# EAGLE design record_revb (EAGLE 7.2.0)
Ekho Mobile Recording Front-End Board (Rev A) Provides signal conditioning, amplification, and adjustment for the I-V Controller.

## Sheet 1 of 3: Recording Analog Front-End
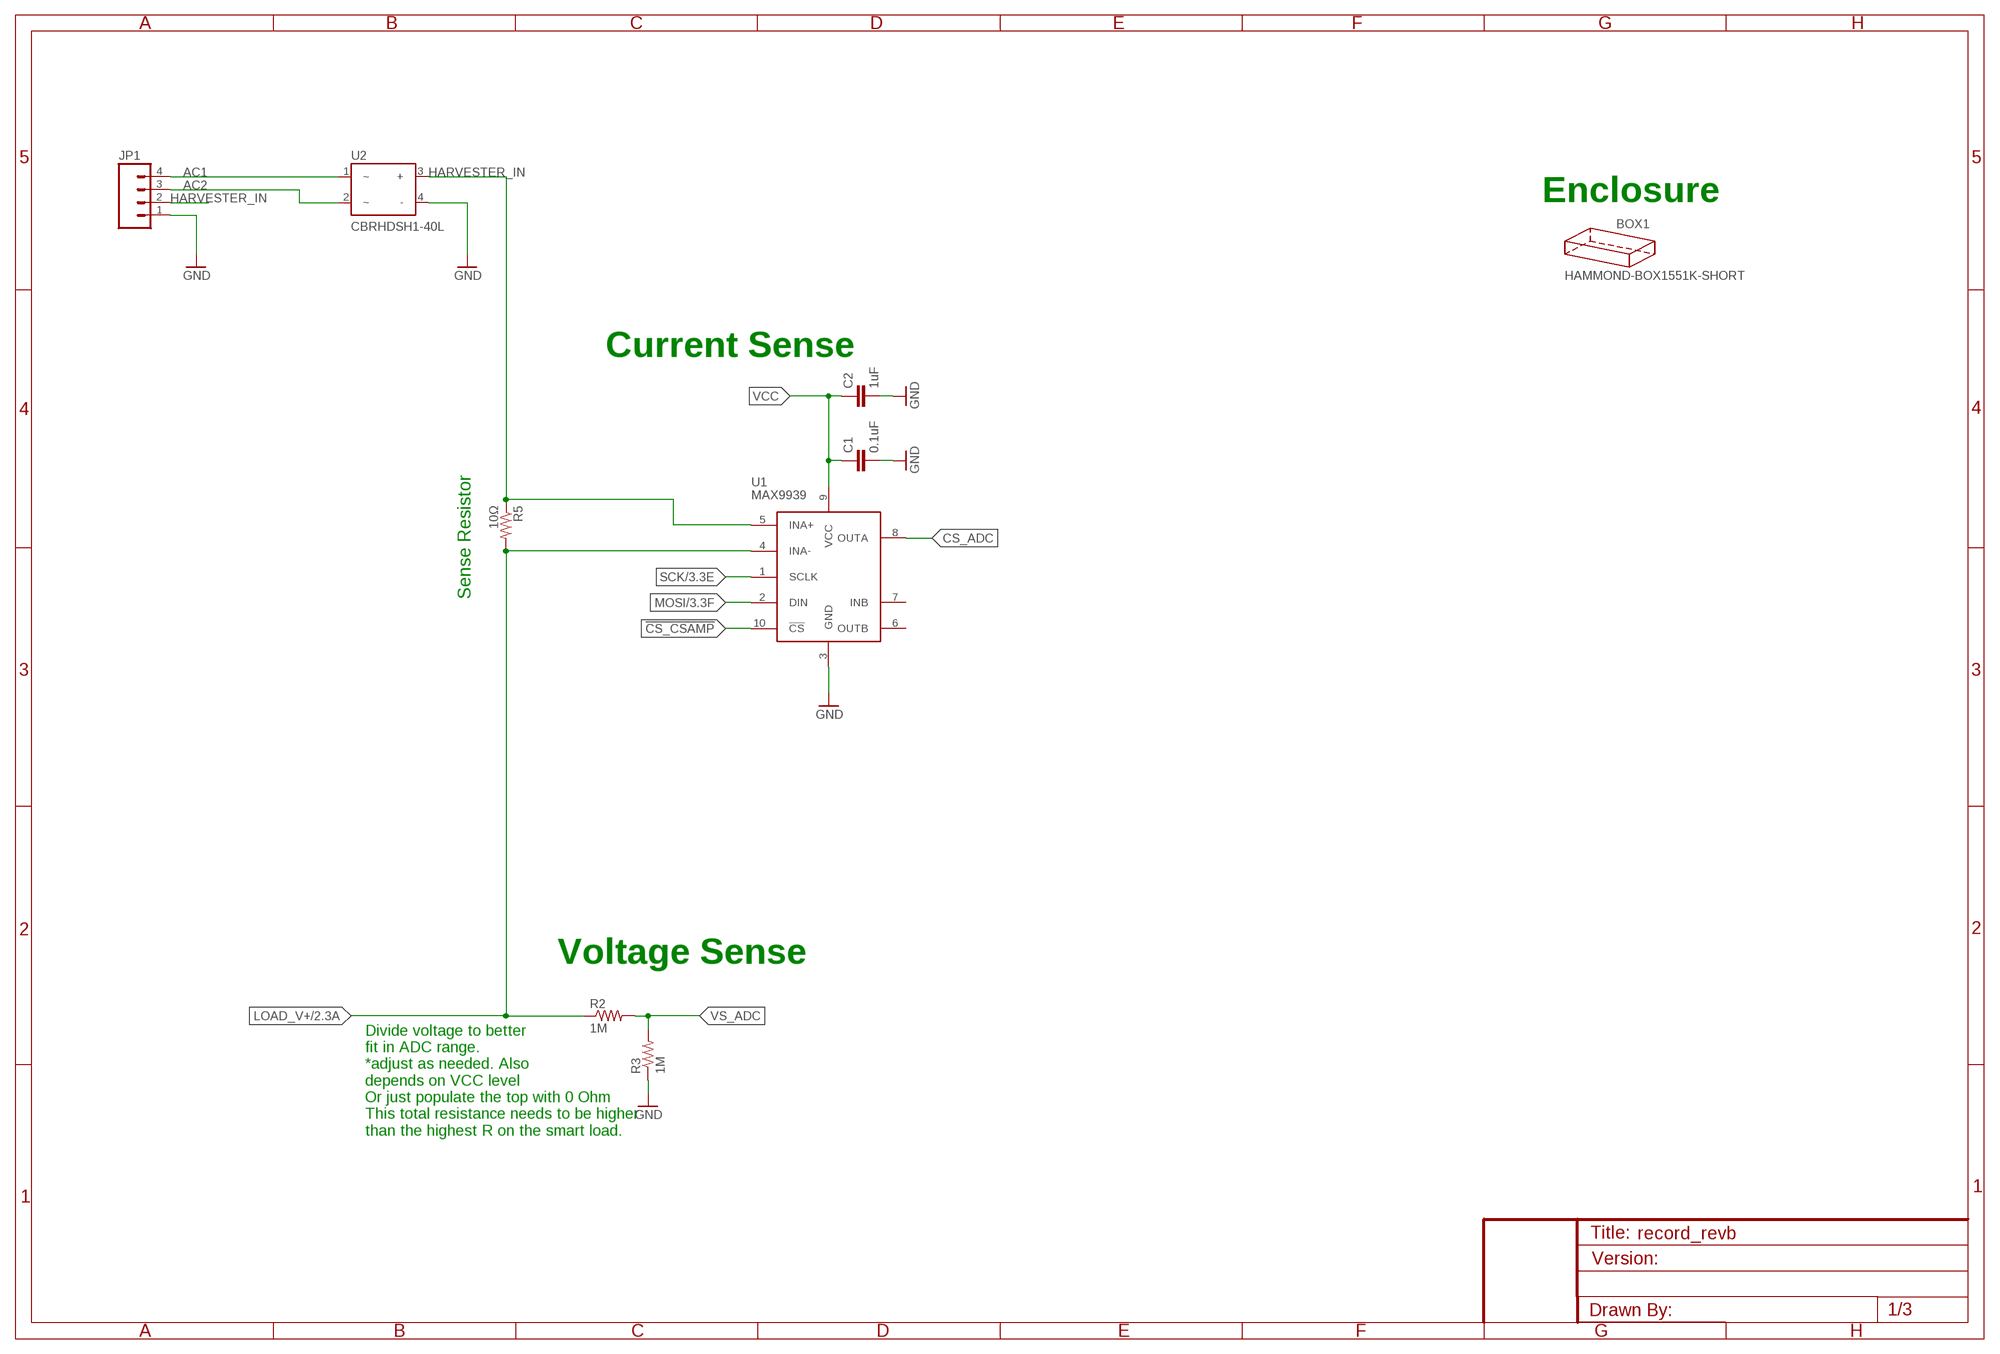
[diagram p0: schematic, sheet 1]

### Parts
BOX1  HAMMOND-BOX1551K-SHORT  [1551K-SHORT]
C1  0.1uF  CAP0805  [C0805]
C2  1uF  CAP0805  [C0805]
JP1  M04PTH  [1X04]
R2  1M  RESISTOR0805-RES  [0805]
R3  1M  RESISTOR0805-RES  [0805]
R5  10Ω  RESISTOR0805-RES  [0805]
U1  MAX9939  [10µMAX]
U2  CBRHDSH1-40L  [HD_DIP4]

### Nets
!CS_CSAMP: U1.10(!CS) ; also sheet 2
AC1: JP1.4 U2.1(~)
AC2: JP1.3 U2.2(~)
CS_ADC: U1.8(OUTA) ; also sheet 2
GND: C1.2 C2.2 JP1.1 R3.1 U1.3(GND) U2.4(-) ; also sheet 2,3
HARVESTER_IN: JP1.2 R5.1 U1.5(INA+) U2.3(+)
LOAD_V+: R2.1 R5.2 U1.4(INA-) ; also sheet 2
MOSI: U1.2(DIN) ; also sheet 2,3
SCK: U1.1(SCLK) ; also sheet 2,3
VCC: C1.1 C2.1 U1.9(VCC) ; also sheet 2,3
VS_ADC: R2.2 R3.2 ; also sheet 2
Unconnected: U1.6(OUTB) U1.7(INB)

### Notes on the sheet
- Enclosure
- Current Sense
- Sense Resistor
- Voltage Sense
- Divide voltage to better 
  fit in ADC range.
  *adjust as needed. Also
  depends on VCC level
  Or just populate the top with 0 Ohm
  This total resistance needs to be higher
  than the highest R on the smart load.

## Sheet 2 of 3: Digital Ctrl, Battery, Smart Load
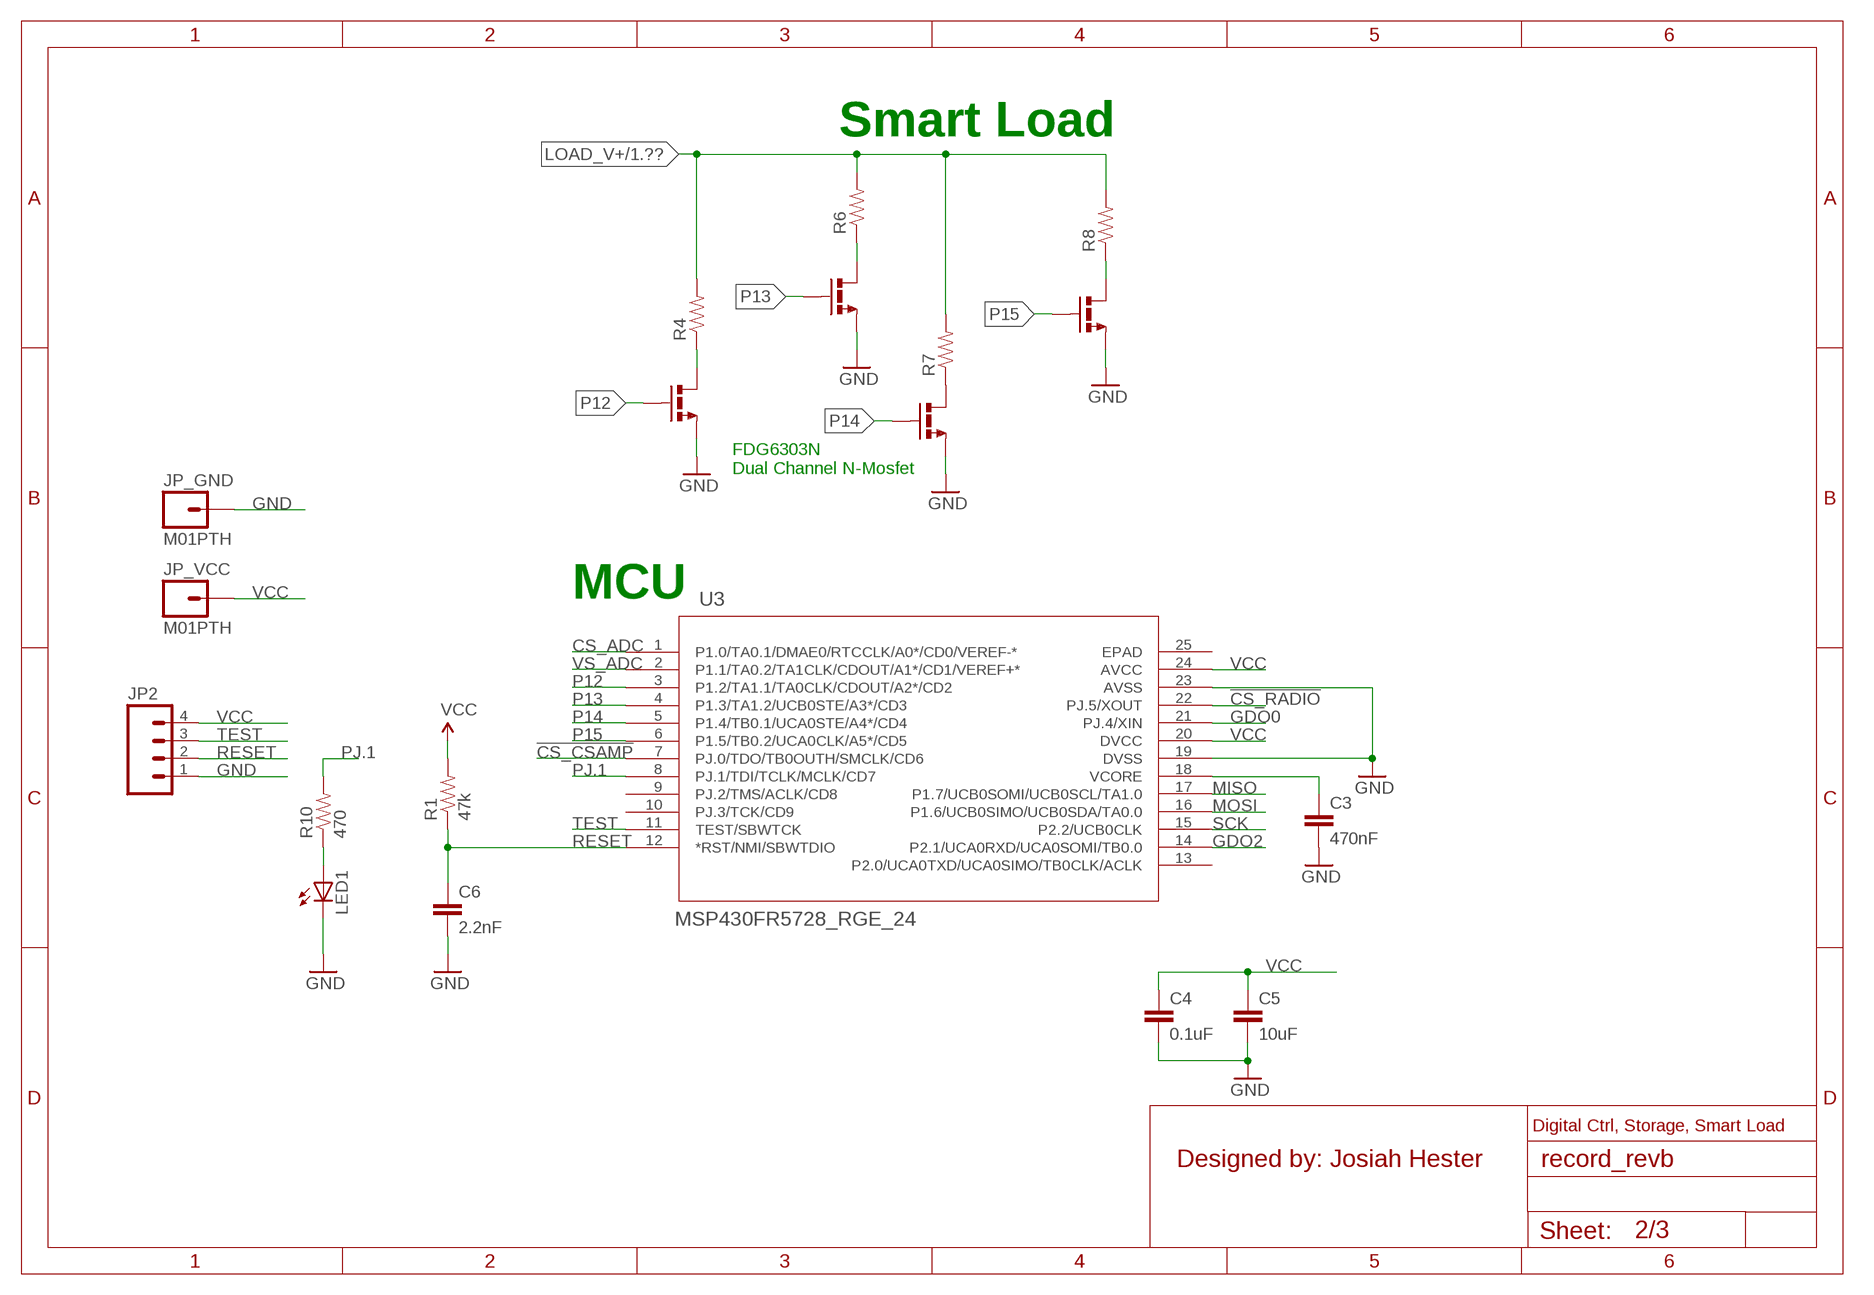
[diagram p1: schematic, sheet 2]

### Parts
C3  470nF  1UF-25V-10%(0805)  [0805]
C4  0.1uF  1UF-25V-10%(0805)  [0805]
C5  10uF  1UF-25V-10%(0805)  [0805]
C6  2.2nF  1UF-25V-10%(0805)  [0805]
JP2  M04PTH  [1X04]
JP_GND  M01PTH  [1X01]
JP_VCC  M01PTH  [1X01]
LED1  LED0603  [LED-0603]
R1  47k  0.22OHM1/4W1%(0805)  [0805]
R4  0.22OHM1/4W1%(0805)  [0805]
R6  0.22OHM1/4W1%(0805)  [0805]
R7  0.22OHM1/4W1%(0805)  [0805]
R8  0.22OHM1/4W1%(0805)  [0805]
R10  470  0.22OHM1/4W1%(0805)  [0805]
U3  MSP430FR5728_RGE_24  [RGE24_2P1X2P1]
U4  FDG6303N  [SC70-6]
U5  FDG6303N  [SC70-6]

### Nets
!CS_CSAMP: U3.7(PJ.0/TDO/TB0OUTH/SMCLK/CD6) ; also sheet 1
!CS_RADIO: U3.22(PJ.5/XOUT) ; also sheet 3
CS_ADC: U3.1(P1.0/TA0.1/DMAE0/RTCCLK/A0*/CD0/VEREF-*) ; also sheet 1
GDO0: U3.21(PJ.4/XIN) ; also sheet 3
GDO2: U3.14(P2.1/UCA0RXD/UCA0SOMI/TB0.0) ; also sheet 3
GND: C3.2 C4.2 C5.2 C6.2 JP2.1 JP_GND.1 LED1.C U3.19(DVSS) U3.23(AVSS) U4.1(S2) U4.4(S1) U5.1(S2) U5.4(S1) ; also sheet 1,3
LOAD_V+: R4.2 R6.2 R7.2 R8.2 ; also sheet 1
MISO: U3.17(P1.7/UCB0SOMI/UCB0SCL/TA1.0) ; also sheet 3
MOSI: U3.16(P1.6/UCB0SIMO/UCB0SDA/TA0.0) ; also sheet 1,3
N$1: C3.1 U3.18(VCORE)
N$3: R7.1 U5.3(D1)
N$4: R8.1 U5.6(D2)
N$5: R6.1 U4.6(D2)
N$6: R4.1 U4.3(D1)
N$11: LED1.A R10.1
P12: U3.3(P1.2/TA1.1/TA0CLK/CDOUT/A2*/CD2) U4.5(G1)
P13: U3.4(P1.3/TA1.2/UCB0STE/A3*/CD3) U4.2(G2)
P14: U3.5(P1.4/TB0.1/UCA0STE/A4*/CD4) U5.5(G1)
P15: U3.6(P1.5/TB0.2/UCA0CLK/A5*/CD5) U5.2(G2)
PJ.1: R10.2 U3.8(PJ.1/TDI/TCLK/MCLK/CD7)
RESET: C6.1 JP2.2 R1.1 U3.12(*RST/NMI/SBWTDIO)
SCK: U3.15(P2.2/UCB0CLK) ; also sheet 1,3
TEST: JP2.3 U3.11(TEST/SBWTCK)
VCC: C4.1 C5.1 JP2.4 JP_VCC.1 R1.2 U3.20(DVCC) U3.24(AVCC) ; also sheet 1,3
VS_ADC: U3.2(P1.1/TA0.2/TA1CLK/CDOUT/A1*/CD1/VEREF+*) ; also sheet 1
Unconnected: U3.9(PJ.2/TMS/ACLK/CD8) U3.10(PJ.3/TCK/CD9) U3.13(P2.0/UCA0TXD/UCA0SIMO/TB0CLK/ACLK) U3.25(EPAD)

### Notes on the sheet
- Smart Load
- FDG6303N
  Dual Channel N-Mosfet
- MCU
- Digital Ctrl, Storage, Smart Load
- Designed by: Josiah Hester

## Sheet 3 of 3
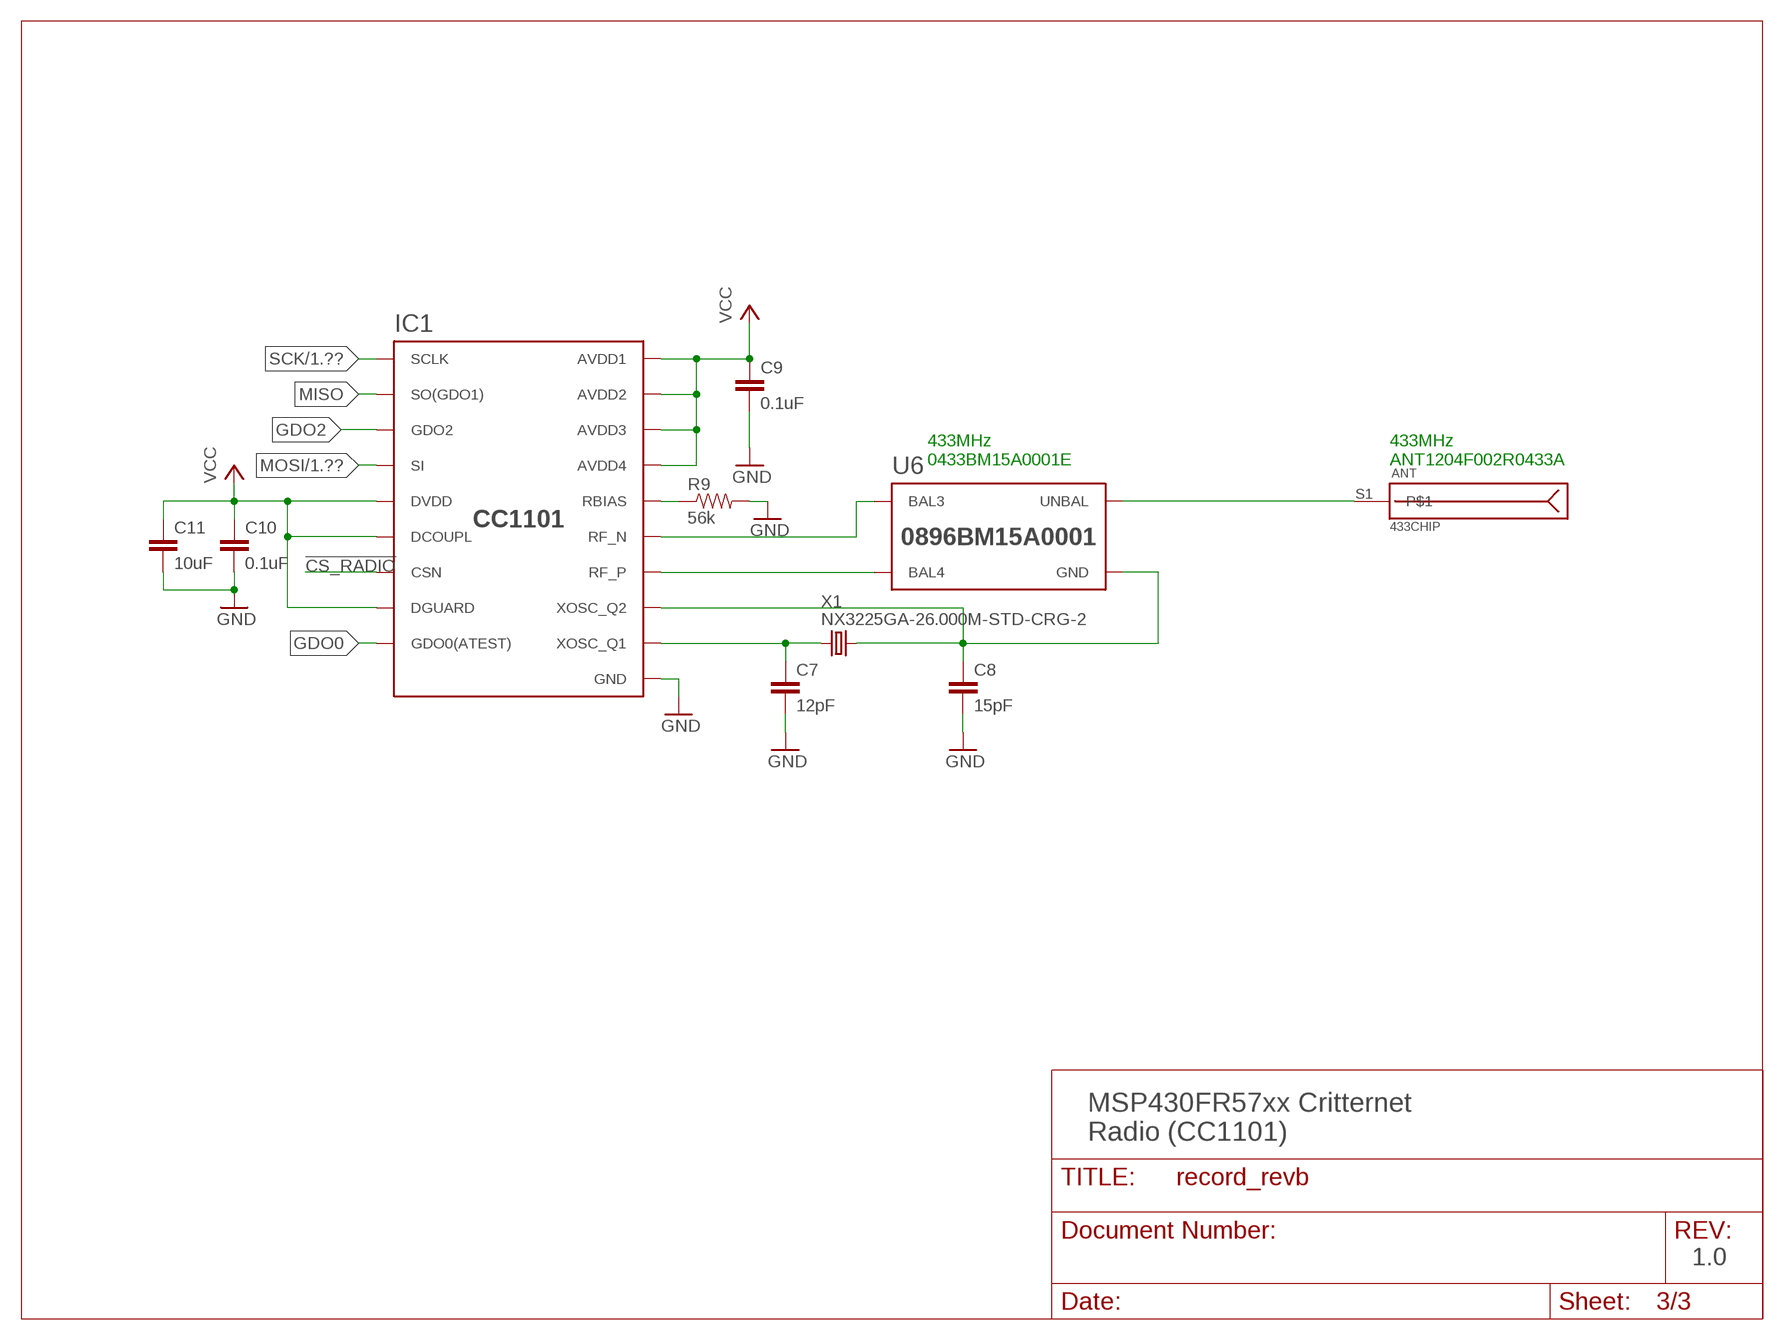
[diagram p2: schematic, sheet 3]

### Parts
ANT  433CHIP  [ANT-433-USP]
C7  12pF  0.1UF-25V(+80/-20%)(0603)  [0603-CAP]
C8  15pF  0.1UF-25V(+80/-20%)(0603)  [0603-CAP]
C9  0.1uF  CAP0603-CAP  [0603-CAP]
C10  0.1uF  CAP0805  [C0805]
C11  10uF  1.0UF-25V-+80/-20(0805)  [0805]
IC1  CC1101  [QLP20]
R9  56k  0OHM1/10W5%(0603)  [0603]
U6  0896BM15A0001  [0896BM15A0001]
X1  NX3225GA-26.000M-STD-CRG-2  XTAL-3.2X2.5  [XTAL-3.2X2.5]

### Nets
!CS_RADIO: IC1.7(CSN) ; also sheet 2
GDO0: IC1.6(GDO0(ATEST)) ; also sheet 2
GDO2: IC1.3(GDO2) ; also sheet 2
GND: C7.2 C8.2 C9.2 C10.2 C11.2 IC1.16(GND) IC1.19(GND) IC1.GND IC1.GND1(GND) IC1.GND2(GND) IC1.GND3(GND) IC1.GND4(GND) IC1.GND5(GND) R9.2 ; also sheet 1,2
MISO: IC1.2(SO(GDO1)) ; also sheet 2
MOSI: IC1.20(SI) ; also sheet 1,2
N$2: IC1.12(RF_P) U6.4(BAL4)
N$7: IC1.13(RF_N) U6.3(BAL3)
N$8: C7.1 IC1.8(XOSC_Q1) X1.1
N$9: IC1.17(RBIAS) R9.1
N$15: ANT.S1 U6.1(UNBAL)
SCK: IC1.1(SCLK) ; also sheet 1,2
VCC: C9.1 C10.1 C11.1 IC1.4(DVDD) IC1.5(DCOUPL) IC1.9(AVDD1) IC1.11(AVDD2) IC1.14(AVDD3) IC1.15(AVDD4) IC1.18(DGUARD) ; also sheet 1,2
XOSC_Q2: C8.1 IC1.10(XOSC_Q2) U6.2(GND) U6.5(GND) U6.6(GND) X1.3

### Notes on the sheet
- 433MHz
  0433BM15A0001E
- 433MHz
  ANT1204F002R0433A
- MSP430FR57xx Critternet
  Radio (CC1101)
- 1.0

## Library data of the parts
ANT = HF-Bauteile:433CHIP
BOX1 = hammond:HAMMOND-BOX: Hammond Project boxes Hammond 1551 Transluscent Blue 50x35x20mm 1551GTBU http://www.hammondmfg.com/pdf/1551G.pdf Hammond 1551 Transluscent Blue 50x50x20mm 1551RTBU http://www.hammondmfg.com/pdf/1551R.pdf Hammond 1551 Transluscent Blue 60x35x20mm 1551HTBU http://www.hammondmfg.com/pdf/1551H.pdf Hammond 1551 Transluscent Blue 80x40x20mm 1551KTBU http://www.hammondmfg.com/pdf/1551K.pdf Hammond 1591 Transluscent Blue 100x51x22m m 1591XXATBU http://www.hammondmfg.com/pdf/1591XXA.pdf
C1 C2 C9 C10 = SparkFun-Capacitors:CAP: Capacitor Standard 0603 ceramic capacitor, and 0.1" leaded capacitor.
C3-C6 = SparkFun-Capacitors:1UF-25V-10%(0805): CAP-08064; PROD_ID: CAP-08064; VALUE: 1uF
C7 C8 = SparkFun-Capacitors:0.1UF-25V(+80/-20%)(0603): CAP-00810 Ceramic Standard decoupling cap; PROD_ID: CAP-00810; VALUE: 0.1uF
C11 = SparkFun-Capacitors:1.0UF-25V-+80/-20(0805); PROD_ID: CAP-11625; VALUE: 1.0uF
IC1 = cc1101:CC1101
JP1 JP2 = SparkFun-Connectors:M04: Header 4 Standard 4-pin 0.1" header. Use with straight break away headers (SKU : PRT-00116), right angle break away headers (PRT-00553), swiss pins (PRT-00743), machine pins (PRT-00117), and female headers (PRT-00115). Molex polarized connector foot print use with SKU : PRT-08231 with associated crimp pins and housings. 1MM SMD Version SKU: PRT-10208
JP_GND JP_VCC = SparkFun-Connectors:M01: Header 1 Standard 1-pin 0.1" header. Use with straight break away headers (SKU : PRT-00116), right angle break away headers (PRT-00553), swiss pins (PRT-00743), machine pins (PRT-00117), and female headers (PRT-00115).
LED1 = SparkFun-LED:LED: LEDs Standard schematic elements and footprints for 5mm, 3mm, 1206, and 0603 sized LEDs. 5mm - Spark Fun Electronics SKU : COM-00529 (and others)
R1 R4 R6-R8 R10 = SparkFun-Resistors:0.22OHM1/4W1%(0805): RES-09883; PROD_ID: RES-09883; VALUE: 0.22
R2 R3 = SparkFun-Resistors:RESISTOR: Resistor Basic schematic elements and footprints for 0603, 1206, and PTH resistors.
R5 = SparkFun-Passives:RESISTOR: Resistor Basic schematic elements and footprints for 0603, 1206, and PTH resistors.
R9 = SparkFun-Resistors:0OHM1/10W5%(0603): RES-08609; PROD_ID: RES-08609; VALUE: 0
U1 = ekho:MAX9939: MAX9939: SPI Programmable-Gain Amplifier with Input VOS Trim and Output Op Amp The MAX9939 is a general-purpose, differential-input programmable-gain amplifier (PGA) that is ideal for conditioning a variety of wide dynamic range signals such as those found in motor current-sense, medical instrumentation, and sonar data acquisition applications. It features programmable differential gains from 0.2V/V to 157V/V, input offset-voltage compensation, and an output amplifier that can be configured either as a highorder active filter or to provide a differential output. The PGA is optimized for high-signal bandwidth and its gain can be programmed to be 0.2V/V, 1V/V, 10V/V, 20V/V, 30V/V, 40V/V, 60V/V, 80V/V, 119V/V, and 157V/V.
U2 = parts:CBRHDSH1-40L
U3 = msp430:MSP430FR5728_RGE_24; DATASHEETURL: http://www.ti.com/lit/gpn/MSP430FR5728; DESCRIPTION: MSP430FR573x,MSP430FR572x Mixed Signal Microcontroller; FAMILY_NAME: FRAM Series; GENERIC_PART_NUMBER: MSP430FR5728; INDUSTRY_STD_PKG_TYPE: VQFN; MANUFACTURER: Texas Instruments; MANUFACTURER_PART_NUMBER: msp430fr5728_rge_24; PACKAGE_DESIGNATOR: RGE; PIN_COUNT: 24; VENDOR: Texas Instruments
U4 U5 = SparkFun-DiscreteSemi:FDG6303N
U6 = otternet:0896BM15A0001
X1 = cc1101:XTAL

## Net classes
1 Ground: width 0.203 mm, drill 0.61 mm

## Board
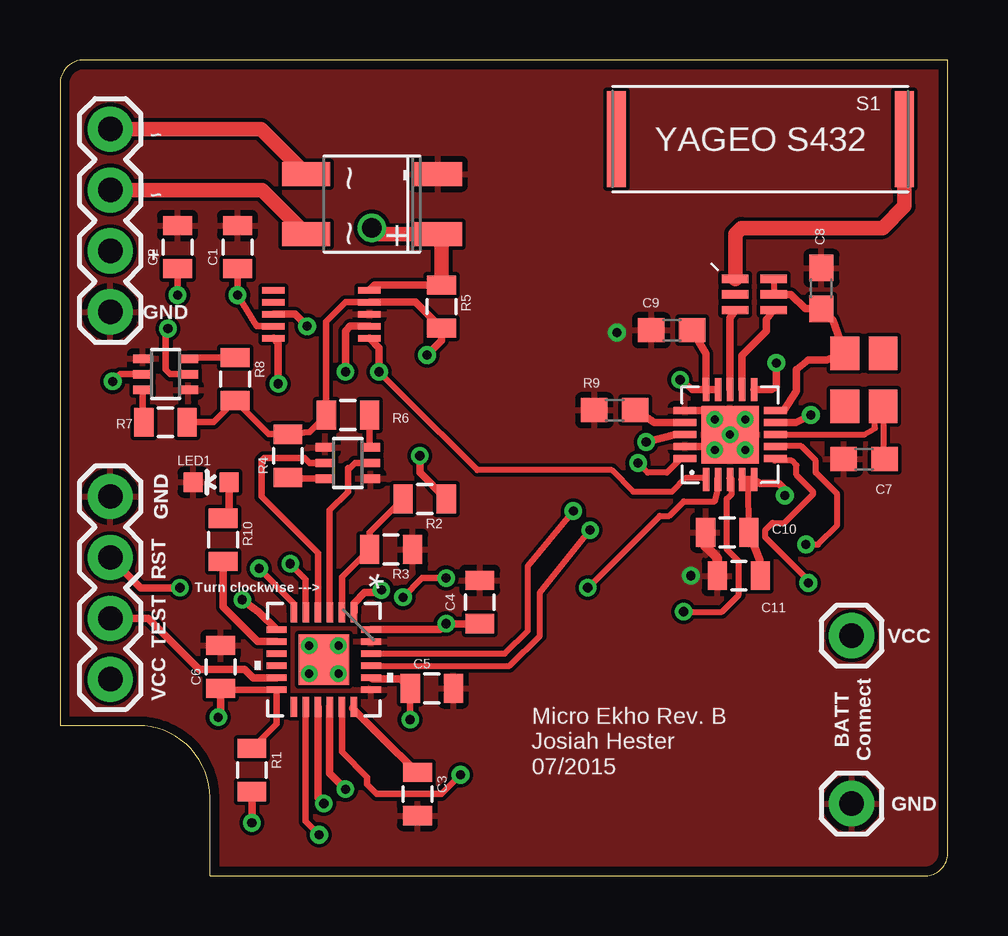
[diagram p3: board, top side]
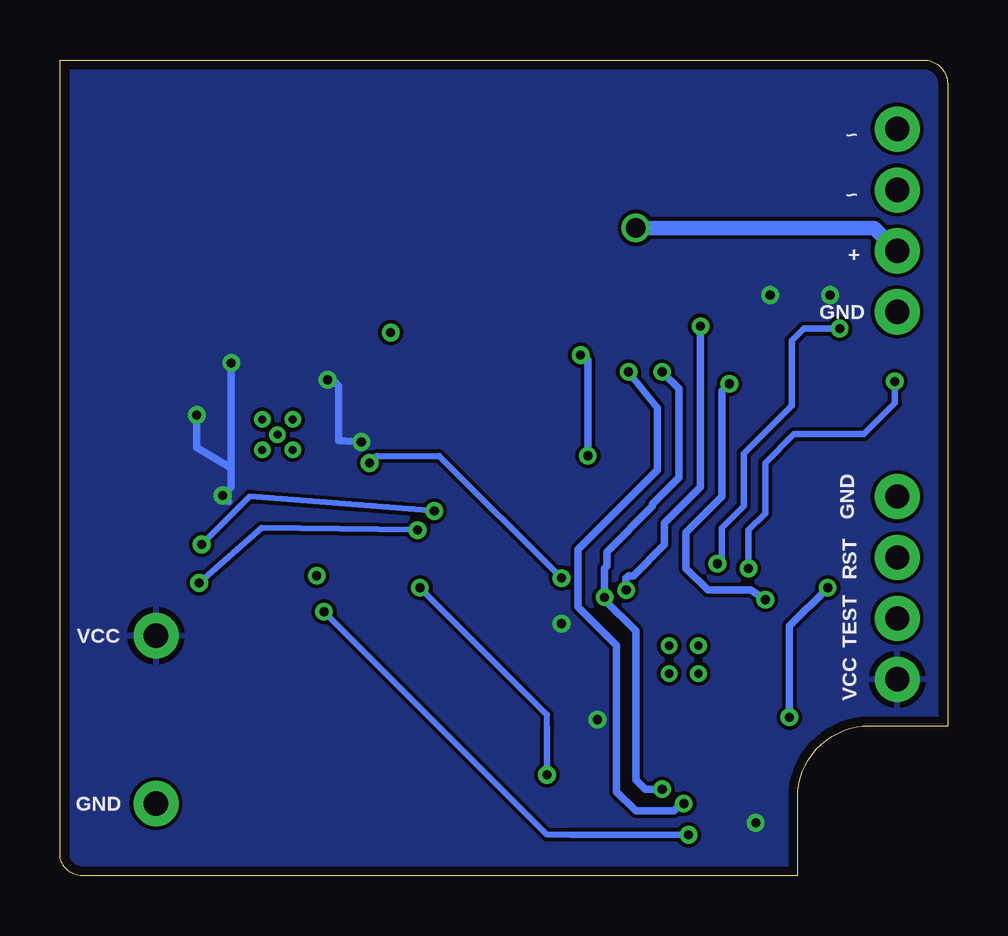
[diagram p4: board, bottom side, seen from below]

Size 37 x 34 mm. Coordinates in mm from the lower left corner, seen from the top.
Copper layers (1*2+15*16): Top 0.0356mm / dielectric 1.5011mm / Route2 0.0356mm / dielectric 0.1499mm / Route15 0.0356mm / dielectric 0.2007mm / Bottom 0.0356mm
Design rules "LaenPCBOrder *": minimum track width 6mil, minimum drill 13mil, track to track 6mil, track to pad 6mil, pad to pad 6mil, via to via 6mil, smd to smd 6mil, copper to edge 15mil, drill to drill 6mil, minimum pad ring 7mil, minimum via ring 7mil, stop-mask expansion 3mil, vias tented up to drill 0mil, thermal gap 10mil

### Footprints (pad centres in the part's own frame; a part is rotated, then mirrored left to right if it is on the bottom)
ANT-433-USP = smd 0.8 x 4: P$4 6,0; S1 -6,0
C0805 = smd 0.8 x 1.2: 1 -0.9,0; 2 0.9,0
0805 = smd 0.8 x 1.2: 1 -0.9,0; 2 0.9,0
0603-CAP = smd 1.1 x 1: 1 -0.85,0; 2 0.85,0
QLP20 = smd 0.96 x 0.28: 1 -1.88,1; 2 -1.88,0.5; 3 -1.88,0; 4 -1.88,-0.5; 5 -1.88,-1; 11 1.88,-1; 12 1.88,-0.5; 13 1.88,0; 14 1.88,0.5; 15 1.88,1 | smd 0.28 x 0.96: 6 -1,-1.88; 7 -0.5,-1.88; 8 0,-1.88; 9 0.5,-1.88; 10 1,-1.88; 16 1,1.88; 17 0.5,1.88; 18 0,1.88; 19 -0.5,1.88; 20 -1,1.88 | smd 2.4 x 2.4: GND 0,0 | drill 0.333: GND1 0,0; GND2 -0.635,0.635; GND3 0.635,0.635; GND4 -0.635,-0.635; GND5 0.635,-0.635
1X04 = drill 1.016 pad 1.88: 1 0,0; 2 2.54,0; 3 5.08,0; 4 7.62,0
1X01 = drill 1.016 pad 1.88: 1 0,0
LED-0603 = smd 0.8 x 0.8: A 0,-0.75; C 0,0.75
0603 = smd 1.1 x 1: 1 -0.85,0; 2 0.85,0
10µMAX = smd 0.27 x 0.94: 1 -1,-2; 2 -0.5,-2; 3 0,-2; 4 0.5,-2; 5 1,-2; 6 1,2; 7 0.5,2; 8 0,2; 9 -0.5,2; 10 -1,2
HD_DIP4 = smd 1 x 2: 1 -1.25,-2.75; 2 1.25,-2.75; 3 1.25,2.75; 4 -1.25,2.75
RGE24_2P1X2P1 = smd 0.838 x 0.279: 1 -1.975,1.25; 2 -1.975,0.75; 3 -1.975,0.25; 4 -1.975,-0.25; 5 -1.975,-0.75; 6 -1.975,-1.25; 13 1.975,-1.25; 14 1.975,-0.75; 15 1.975,-0.25; 16 1.975,0.25; 17 1.975,0.75; 18 1.975,1.25 | smd 0.279 x 0.838: 7 -1.25,-1.975; 8 -0.75,-1.975; 9 -0.25,-1.975; 10 0.25,-1.975; 11 0.75,-1.975; 12 1.25,-1.975; 19 1.25,1.975; 20 0.75,1.975; 21 0.25,1.975; 22 -0.25,1.975; 23 -0.75,1.975; 24 -1.25,1.975 | smd 2.108 x 2.108: 25 0,0 | drill 0.34: V -0.583,-0.608; V_1 -0.583,0.608; V_2 0.583,-0.608; V_3 0.583,0.608
SC70-6 = smd 0.35 x 0.8: 1 -0.65,-0.95; 2 0,-0.95; 3 0.65,-0.95; 4 0.65,0.95; 5 0,0.95; 6 -0.65,0.95
0896BM15A0001 = smd 0.35 x 1.1: 1 0.65,0.8; 2 0,0.8; 3 -0.65,0.8; 4 -0.65,-0.8; 5 0,-0.8; 6 0.65,-0.8
XTAL-3.2X2.5 = smd 1.4 x 1.2: 1 -1.1,-0.8; 2 1.1,-0.8; 3 1.1,0.8; 4 -1.1,0.8

### Placement (x,y rotation side)
ANT  29.2,30.7 180 top
BOX1  0,0 0 top
C1  7.4,26.2 90 top
C2  4.9,26.2 90 top
C3  14.9,3.4 270 top
C4  17.5,11.4 90 top
C5  15.5,7.8 0 top
C6  6.7,8.7 90 top
C7  33.52,17.37 180 top
C8  31.74,24.48 90 top
C9  25.5,22.74 180 top
C10  27.82,14.3 180 top
C11  28.3,12.5 180 top
IC1  27.93,18.38 90 top
JP1  2.1,23.5 90 top
JP2  2.1,15.8 270 top
JP_GND  33,3 0 top
JP_VCC  33,10 0 top
LED1  6.3,16.4 90 top
R1  8,4.4 270 top
R2  15.2,15.7 180 top
R3  13.8,13.6 180 top
R4  9.5,17.5 90 top
R5  15.9,23.72 270 top
R6  12,19.2 180 top
R7  4.4,18.9 0 top
R8  7.3,20.7 270 top
R9  23.12,19.4 180 top
R10  6.8,14 270 top
U1  10.9,23.4 90 top
U2  13,28 270 top
U3  11,9 270 top
U4  12,17.2 270 top
U5  4.4,20.9 270 top
U6  28.95,24.22 90 top
X1  33.51,20.67 90 top

### Tracks (layer width: path | path; a pad name or v marks a point on that pad's centre or on a via)
!CS_CSAMP  (via drill 0.38)
  Top 0.305: U3.7 8.28,11 v7.6,11.5 | v9.1,20.5 9.1,22.2 U1.10
  Bottom 0.305: v7.6,11.5 8.2,11.9 10,11.9 10.9,12.8 10.9,14.3 9.4,15.8 9.4,20.2 v9.1,20.5
!CS_RADIO  (via drill 0.38)
  Top 0.254: U3.22 18.55,9.25 19.5,10.2 19.5,12.9 v21.4,15.2 | v31.1,13.8 31.6,13.8 32.4,14.6 32.4,15.9 31.5,16.8 31.5,17.3 30.9,17.9 29.73,17.9 IC1.7
  Bottom 0.254: v21.4,15.2 29.1,15.8 v31.1,13.8
AC1
  Top 0.61: U2.1 8.38,31.12 JP1.4
AC2
  Top 0.61: U2.2 8.42,28.58 JP1.3
CS_ADC  (via drill 0.38)
  Top 0.305: U3.1 12.25,11.35 12.7,11.8 13.3,11.8 v13.4,11.9 | v10.3,22.9 9.8,23.4 U1.8
  Bottom 0.305: v13.4,11.9 13.4,12.4 13.3,12.5 13.1,12.5 11.8,13.8 11.8,14.7 10.3,16.2 v10.3,22.9
GDO0  (via drill 0.38)
  Top 0.254: U3.21 18.75,8.75 20,10 20,11.8 v22.1,14.4 | v31.2,12.2 31.2,12.3 29.4,14.1 29.4,14.4 29.7,14.7 30.2,14.7 31.4,15.9 31.4,16 30.7,16.7 30.7,17.1 30.5,17.3 29.8,17.3 IC1.6
  Bottom 0.254: v22.1,14.4 28.6,14.5 v31.2,12.2
GDO2  (via drill 0.38)
  Top 0.152: 27.92,16.57 IC1.3
  Top 0.254: 27.9,16.57 IC1.3 28,16.54 28,15.9 27.8,15.7 27.8,13.6 28.3,13.1 28.3,11.7 27.6,11 v26,11
  Top 0.28: U3.14 10.25,2.25 v10.8,1.7
  Bottom 0.254: 15.7,1.7 16.7,1.7 v26,11
  Bottom 0.28: v10.8,1.7 15.7,1.7
GND  (via drill 0.38)
  Top 0.254: IC1.GND3 IC1.GND5 IC1.GND | IC1.GND IC1.GND4 | 27.16,17.88 27.43,17.88 IC1.GND
  Top 0.305: IC1.19 27.16,17.88 IC1.GND2 | IC1.16 26.93,19.38 IC1.GND3
  Top 0.406: C11.2 27.4,13.23 26.9,13.73 26.9,14.23 C10.2
  other vias: 23.22,22.64 26.3,12.5
  pour Top: 36.9,34.3 0,34.3 0,0.1 37,0.1
HARVESTER_IN  (via drill 0.8)
  Top 0.305: R5.1 13.12,24.62 U1.5
  Top 0.61: R5.1 15.9,26.6 U2.3 13.25,26.75 v13,27
  Bottom 0.61: JP1.2 3.06,27 v13,27
LOAD_V+  (via drill 0.38)
  Top 0.28: R7.2 6.4,18.9 R8.2 8.7,18.4 R4.2 10.4,18.5 R6.2 11.1,23.1 11.9,23.9 U1.4
  Top 0.305: U1.4 14.82,23.9 R5.2 15.9,22.3 v15.3,21.7 | R2.1 15,16.8 v15,17.5
  Bottom 0.305: v15,17.5 15,21.5 15.2,21.7 v15.3,21.7
MISO  (via drill 0.38)
  Top 0.254: v22,12 25,15 25.4,15 26,15.6 27.3,15.6 27.4,16 27.4,16.57 IC1.2
  Top 0.28: U3.17 11.75,5.15 12.8,4.1 12.8,3.8 13.2,3.4 15.9,3.4 v16.7,4.2
  Bottom 0.254: 16.7,6.16 16.7,6.7 v22,12
  Bottom 0.28: v16.7,4.2 16.7,6.16
MOSI  (via drill 0.38)
  Top 0.254: IC1.20 25.88,17.38 25.3,16.8 24.5,16.8 v24.1,17.2
  Top 0.28: v16.1,12.4 15.1,12.4 v14.3,11.6
  Top 0.305: U3.16 11.25,4.25 v11.9,3.6 | v11.9,21 11.9,22.7 12.1,22.9 U1.2
  Bottom 0.254: v24.1,17.2 23.8,17.5 21.2,17.5 v16.1,12.4
  Bottom 0.305: v11.9,3.6 12.6,3.6 13,4 13,10.2 14.3,11.5 v14.3,11.6 14.3,12.8 14.2,12.9 14.2,13.5 12.3,15.4 12.3,15.5 11.2,16.6 11.2,20.3 v11.9,21
N$1
  Top 0.28: 12.2,6.97 U3.18
  Top 0.305: 12.2,6.97 13.88,5.3 C3.1
N$2
  Top 0.305: IC1.12 28.43,21.68 29.46,22.7 29.46,23.18 U6.4
N$3
  Top 0.28: U5.3 3.45,18.95 R7.1
N$4
  Top 0.28: R8.1 5.4,21.6 U5.6
N$5
  Top 0.28: U4.6 12.9,17.9 R6.1
N$6
  Top 0.28: R4.1 9.65,16.55 U4.3
N$7
  Top 0.305: U6.3 27.92,23.25 27.93,20.92 IC1.13
N$8
  Top 0.254: IC1.8 33.52,18.38 33.98,18.64 33.98,19.53 X1.1 34.32,17.42 C7.1
N$9
  Top 0.305: R9.1 24.79,18.88 IC1.17
N$11
  Top 0.305: R10.1 7.05,15.15 LED1.A
N$15
  Top 0.61: U6.1 28.15,26.75 28.4,27 34.3,27 35.2,27.9 ANT.S1
P12
  Top 0.28: U3.3 11.25,15.25 12,16 12,17 12.1,17 12.3,17.2 U4.5
P13
  Top 0.28: U3.4 10.75,13.45 8.4,15.8 8.4,17.3 8.5,17.4 10.2,17.4 10.4,17.2 U4.2
P14  (via drill 0.38)
  Top 0.28: U3.5 10.25,12.35 v9.6,13 | v4.5,22.8 4.4,22.7 4.4,21.1 4.6,20.9 U5.5
  Bottom 0.28: v9.6,13 9.4,13.2 9.4,14.5 8.5,15.4 8.5,17.6 6.5,19.6 6.5,22.3 6,22.8 v4.5,22.8
P15  (via drill 0.38)
  Top 0.28: U3.6 9.75,11.35 v8.3,12.8 | v2.2,20.6 2.5,20.9 U5.2
  Bottom 0.28: v8.3,12.8 8.3,14.4 7.6,15.1 7.6,17.2 6.4,18.4 3.5,18.4 2.2,19.7 v2.2,20.6
PJ.1
  Top 0.305: U3.8 8.25,9.75 6.8,11.2 R10.2
RESET  (via drill 0.38)
  Top 0.28: R1.1 9.03,6.33 U3.12 6.75,7.75 C6.1
  Top 0.305: JP2.2 3.36,12 v5,12 | v6.6,6.6 6.7,6.7 C6.1
  Bottom 0.305: v5,12 6.6,10.4 v6.6,6.6
SCK  (via drill 0.38)
  Top 0.152: 26.93,16.57 IC1.1
  Top 0.254: 26.93,16.57 26.07,16.57 25.5,16 23.9,16 23,16.9 17.4,16.9 14.3,20
  Top 0.28: 14.3,20 v13.3,21
  Top 0.305: U3.15 10.75,3.25 v11,3 | v13.3,21 13.3,22 U1.1
  Bottom 0.305: v11,3 11.1,3 11.4,2.7 13,2.7 13.8,3.5 13.8,9.6 15.4,11.2 15.4,13.6 12.1,16.9 12.1,19.5 v13.3,21
TEST
  Top 0.305: U3.11 8.05,8.25 7.7,8.6 5.8,8.6 3.68,10.72 JP2.3
VCC  (via drill 0.38, 0.38 pad 0.13, 0.38 pad 0.25)
  Top 0.254: C10.1 28.7,16.36 IC1.5
  Top 0.28: C5.1 v14.6,6.5 | 13.03,8.2 U3.20 | v4.9,24.2 C2.1 | C1.1 v7.4,24.2 8.2,22.9 U1.9
  Top 0.305: R1.2 v8,2.2 | 13.03,8.2 14.2,8.2 C5.1 | C4.1 v16.1,10.5 15.85,10.25 U3.24 | IC1.15 26.93,21.76 C9.1 | IC1.15 IC1.14 | IC1.18 25.65,18.38 v24.44,18.07 | v30.22,15.84 30.22,16.1 29.97,16.35 29.19,16.35 IC1.5 IC1.4 | IC1.15 26.36,20.26 v25.85,20.67 | IC1.11 29.66,20.26 29.86,20.36 v29.86,21.37 | IC1.9 30.68,18.88 v31.3,19.2 | C10.1 29.17,13.13 C11.1
  Bottom 0.28: v14.6,6.5 14.6,6.6
  Bottom 0.305: 29.97,15.59 v30.22,15.84 29.86,16.2 29.86,17 | v25.85,20.67 25.65,20.67 25.39,20.41 25.39,18.13 v24.44,18.07 | v29.86,21.37 29.86,17 | v31.3,19.2 31.3,17.84 29.86,17
  pour Bottom: 0,34.3 36.9,34.3 36.8,0 0,0
VS_ADC
  Top 0.28: U3.2 11.75,12.45 R3.2 12.9,14.3 R2.2
XOSC_Q2
  Top 0.254: U6.6 U6.5
  Top 0.305: U6.5 30.47,24.22 31.07,23.63 C8.1 32.21,23.16 X1.3 31.95,21.5 31.2,21.5 30.7,21.1 30.7,20.2 30.18,19.38 IC1.10

### Text on the board
tPlace: ~ | ~ | + | GND | GND | GND | RST | TEST | Turn clockwise ---> | VCC | VCC | BATT / Connect | Micro Ekho Rev. B / Josiah Hester / 07/2015 | GND
bPlace: ~ | ~ | + | GND | GND | RST | TEST | VCC | VCC | GND